# Altium schematic sheet connector_flow.SchDoc
size A
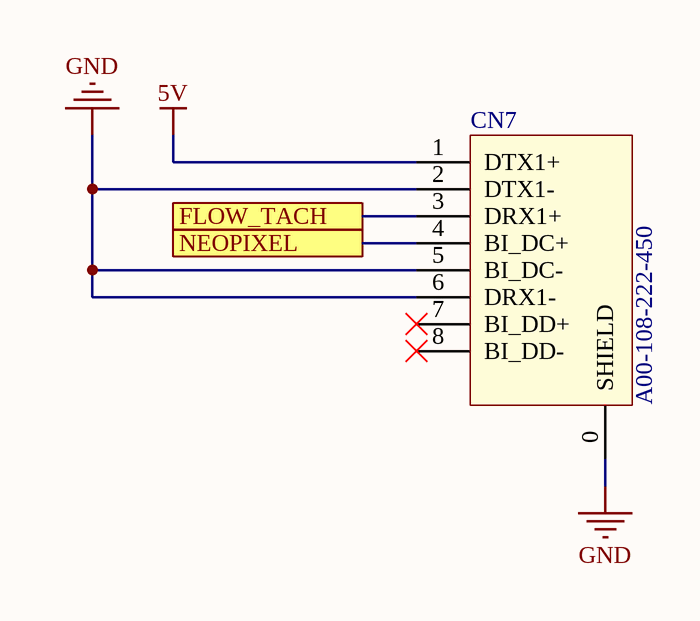
[diagram p0: connector_flow.SchDoc]

## Parts
CN7  MFG P/N: A00-108-222-450  [RJ45 TOP ENTRY EDAC A00-108-222-450]  (hidden comment: CONN_RJ45_TOP_A00-108-222-450)

## Ports
FLOW_TACH, NEOPIXEL

## Nets
5V: CN7.1(DTX1+)
GND: CN7.0(SHIELD) CN7.2(DTX1-) CN7.5(BI_DC-) CN7.6(DRX1-)
FLOW_TACH: CN7.3(DRX1+) ; port FLOW_TACH
NEOPIXEL: CN7.4(BI_DC+) ; port NEOPIXEL

Not connected (* = marked no-connect by the designer): CN7 7(BI_DD+)* 8(BI_DD-)*

## Library data of the parts
CN7 = 492: CONN, RJ-45, 1-PORT, 8-POS, VERT, 0.76um GOLD, TH; ID: 492; MFG: EDAC Inc; COMMON: 210-00203-00; XPN: XS-10003929; Status: In Development; RoHS Compliant: Yes; LOON: 210-00203-00; Gecko: 210-00203-00